# Altium schematic sheet Antenna and LoRa.SchDoc
size A3; SheetNumber: 4; SheetTotal: 4
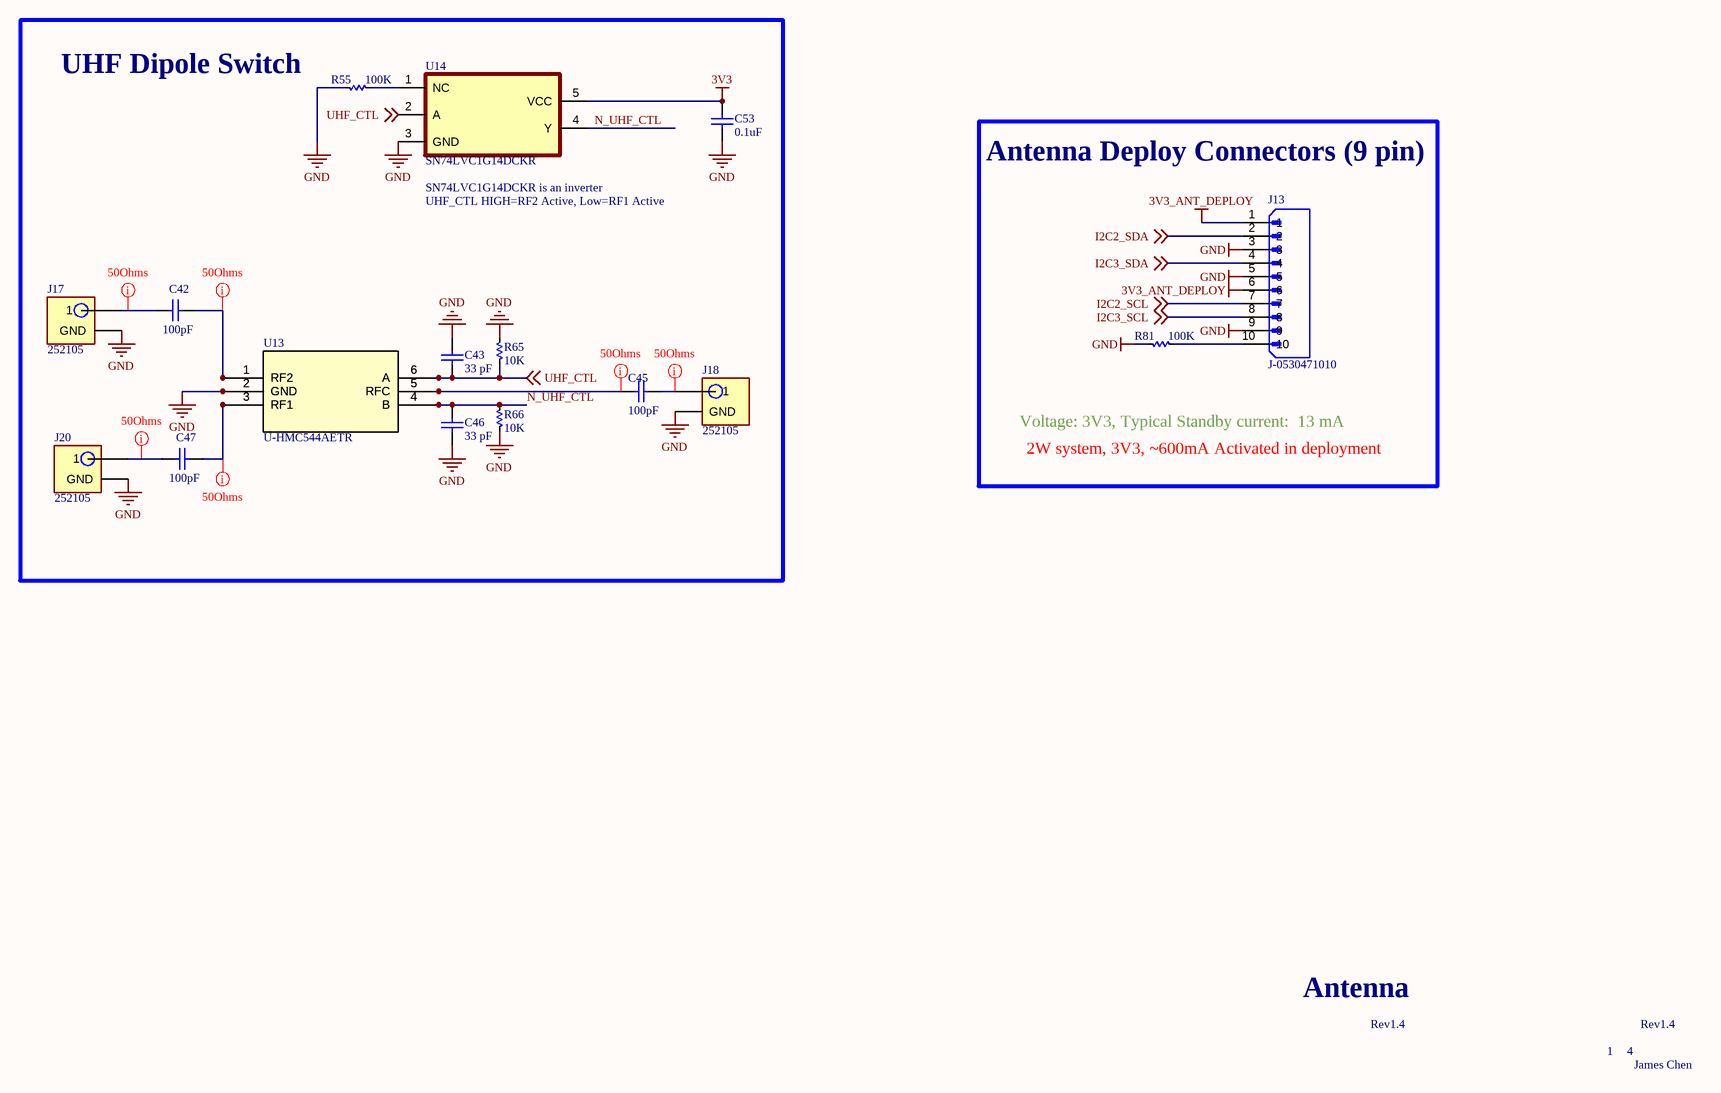
[diagram p0: Antenna and LoRa.SchDoc]

## Parts
C42  100pF  [0603]
C43  33 pF  [0603]
C45  100pF  [0603]
C46  33 pF  [0603]
C47  100pF  [0603]
C53  0.1uF  [0603]
J13  J-0530471010  [J-0530471010]
J17  252105  [J-252105]
J18  252105  [J-252105]
J20  252105  [J-252105]
R55  100K  [0603]  (value not drawn)
R65  10K  [0603]
R66  10K  [0603]
R81  100K  [0603]  (value not drawn)
U13  U-HMC544AETR  [U-HMC544AETR]
U14  SN74LVC1G14DCKR  [U-SN74LVC1G14DCKR]

## Blocks framed on the sheet
UHF Dipole Switch: C42 C43 C45-C47 C53 J17 J18 J20 R55 R65 R66 U13 U14
Antenna Deploy Connectors (9 pin): J13 R81

## Nets
3V3: C53.2 U14.5(VCC)
3V3_ANT_DEPLOY: J13.1 J13.6
GND: C43.2 C46.1 C53.1 J13.3 J13.5 J13.9 J17.0(GND) J18.0(GND) J20.0(GND) R55.1 R65.2 R66.1 R81.1 U13.2(GND) U14.3(GND)
I2C2_SCL: J13.7 ; off-sheet I2C2_SCL
I2C2_SDA: J13.2 ; off-sheet I2C2_SDA
I2C3_SCL: J13.8 ; off-sheet I2C3_SCL
I2C3_SDA: J13.4 ; off-sheet I2C3_SDA
N_UHF_CTL: C46.2 R66.2 U13.4(B) U14.4(Y)
UHF_CTL: C43.1 R65.1 U13.6(A) U14.2(A) ; off-sheet UHF_CTL
NetC42_1: C42.1 J17.1
NetC42_2: C42.2 U13.1(RF2)
NetC45_1: C45.1 U13.5(RFC)
NetC45_2: C45.2 J18.1
NetC47_1: C47.1 J20.1
NetC47_2: C47.2 U13.3(RF1)
NetJ13_10: J13.10 R81.2
NetR55_2: R55.2 U14.1(NC)

## Layout directives
net class 50Ohms: NetC42_1, NetC42_2, NetC45_1, NetC45_2, NetC47_1, NetC47_2

## Notes on the sheet
- (near U14) SN74LVC1G14DCKR is an inverter
- UHF_CTL HIGH=RF2 Active, Low=RF1 Active
- Voltage: 3V3, Typical Standby current:  13 mA
- 2W system, 3V3, ~600mA Activated in deployment
- Antenna
- Rev1.4
- 1
- 4
- James Chen
- THIS DOCUMENT AND THE DATA DISCLOSED HEREIN OR
- HEREWITH IS THE PROPERTY OF ALTIUM LIMITED AND MAY
- DWG NO:
- REVISION
- REV:
- DESCRIPTION
- DATE
- APPROVED
- BE FREELY DISTRIBUTED IN WHOLE. NO RIGHTS ARE
- RESERVED OR EXPRESS OR IMPLIED WARANTEE GIVEN.
- ENG:
- APPROVALS
- PROJECT
- DSN:
- CHK:
- REFERENCE DOCUMENTS
- PROJECT REVISION:
- TITLE
- DOCUMENT REVISION:
- DESIGN ITEM:
- BOM:
- FAB DWG:
- PCB DWG:
- ASSY DWG:
- SCALE:
- A3
- SIZE
- CAGE CODE
- FILE NAME
- DWG NO.
- SHEET
- OF
- REV

## Library data of the parts
C42 C45 C47 = CC-104-K-25V-X5R-0402: CAP CER 100PF 50V X7R 0603; Manufacturer: YAGEO; Manufacturer Part #: CC0603KRX7R9BB101; ComponentLink1description: Datasheet; ComponentLink1URL: https://ds.yuden.co.jp/TYCOMPAS/ut/detail?pn=TMK105BJ104KV-F%20%20&u=M; ComponentLink2description: Manufacturer Website; Distributor: Digikey; Distributor Part #: 311-3601-1-ND; Part Description: CAP CER 100PF 50V X7R 0603; ComponentLink2URL: https://www.yuden.co.jp/or/; Value: 100pF
C43 C46 = CC-339-K-50V-X7R-0603: CAP CER 33PF 50V X7R 0603; Manufacturer: KEMET; Manufacturer Part #: C0603C330K5RAC7867; ComponentLink1description: Datasheet; ComponentLink1URL: https://ds.yuden.co.jp/TYCOMPAS/ut/detail?pn=TMK105BJ104KV-F%20%20&u=M; ComponentLink2description: Manufacturer Website; Distributor: Digikey; Distributor Part #: 399-C0603C330K5RAC7867CT-ND; Part Description: CAP CER 33PF 50V X7R 0603; ComponentLink2URL: https://www.yuden.co.jp/or/; Value: 33 pF
C53 = CC-100nF-25V-X7R-0603: 25V 100nF X7R ±10% 0603 Multilayer Ceramic Capacitors MLCC - SMD/SMT ROHS; Manufacturer: Murata Electronics; Manufacturer Part #: GCJ188R71E104KA12D; Max Exposed Voltage: 6; Rated Voltage: 25; ComponentLink1description: Datasheet; ComponentLink1URL: https://ds.yuden.co.jp/TYCOMPAS/ut/detail?pn=TMK105BJ104KV-F%20%20&u=M; ComponentLink2description: Manufacturer Website; Distributor: LCSC; Distributor Part #: C354391; Part Description: 25V 100nF X7R ±10% 0603 Multilayer Ceramic Capacitors MLCC - SMD/SMT ROHS; ComponentLink2URL: https://www.yuden.co.jp/or/; Value: 0.1uF; Highest Rated Operating Temperature: 125; Lowest Rated Operating Temperature: -55
J13 = J-0530471010: CONN HEADER VERT 10POS 1.25MM; Manufacturer: Molex; Manufacturer Part #: 0530471010; Distributor: Digikey; Distributor Part #: WM1739-ND
J17 J18 J20 = J-252105: CONN MCX RCPT STR 50 OHM PCB; Manufacturer: Amphenol RF; Manufacturer Part #: 252105; Distributor Part #: ACX1262-ND; Distributor: Digikey
R55 R81 = RT-100K0-F-1/16W-0603: RES SMD 100KΩ 0.1% 1/16W 0603; Manufacturer: TE Connectivity; Manufacturer Part #: CPF0603B100KE; ComponentLink2URL: https://www.te.com/commerce/DocumentDelivery/DDEController?Action=showdoc&DocId=Data+Sheet%7F1773200%7FM%7Fpdf%7FEnglish%7FENG_DS_1773200_M.pdf%7F3-1676481-2; ComponentLink2Description: Datasheet; Distributor: Digikey; Distributor Part #: A119912CT-ND; Part Description: RES SMD 100KΩ 0.1% 1/16W 0603; Value: 100K
R65 R66 = RT-10K0-F-1/16W-0603: 10 kOhms ±0.1% 0.063W, 1/16W Chip Resistor 0603 (1608 Metric) - Thin Film; Manufacturer: TE Connectivity Passive Product; Manufacturer Part #: CPF0603B10KE; ComponentLink1description: Datasheet; ComponentLink1URL: https://www.vishay.com/docs/20035/dcrcwe3.pdf; ComponentLink2description: Manufacturer Website; Distributor: Digikey; Distributor Part #: A119886CT-ND; Part Description: 10 kOhms ±0.1% 0.063W, 1/16W Chip Resistor 0603 (1608 Metric) - Thin Film; ComponentLink2URL: https://www.vishay.com/; Value: 10K
U13 = U-HMC544AETR: 0Hz~4GHz 23dB 0.7dB SOT-23-6 RF Switches ROHS; Manufacturer: Analog Devices; Manufacturer Part #: HMC544AETR; Distributor: LCSC; Distributor Part #: C579555; LCSC Part #: C579555
U14 = U-SN74LVC1G14DCKR: IC INVERT SCHMITT 1CH 1IN SC70; Manufacturer: Texas Instruments; Distributor: Digikey; Manufacturer Part #: SN74LVC1G14DCKR; Distributor Part #: 296-11608-1-ND; LCSC Part #: C35740